# EAGLE schematic CHARGING_CIRCUIT_EXTERNAL (EAGLE 8.4.1)
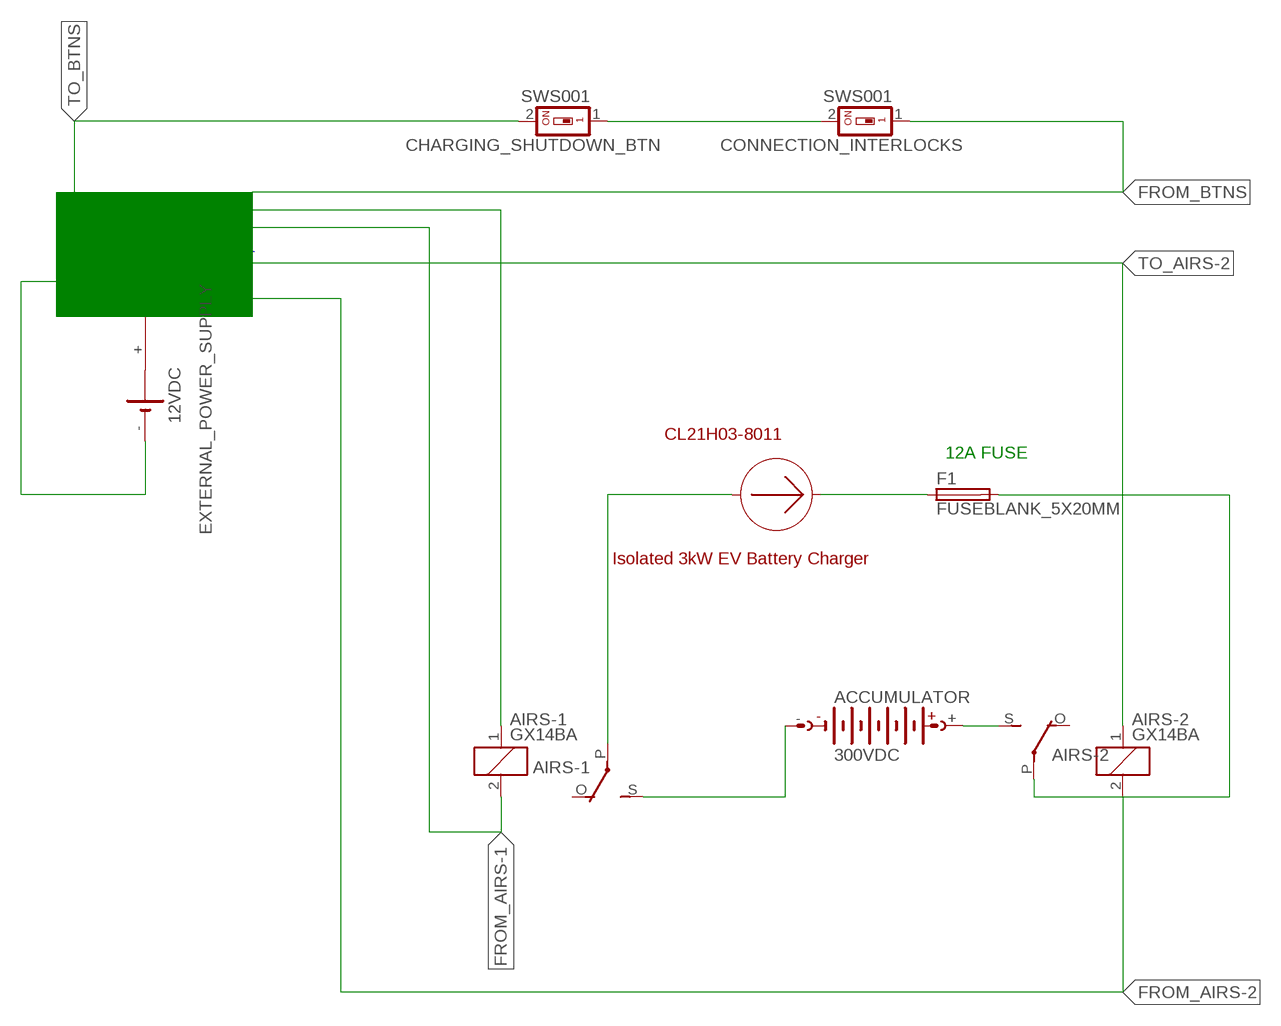
[diagram p0: schematic, sheet 1]

## Parts
ACCUMULATOR  300VDC  AB9V  [AB9V]
AIRS-1  GX14BA  V23127A  [V23127A]
AIRS-2  GX14BA  V23127A  [V23127A]
CHARGING_SHUTDOWN_BTN  SWS001  [SMS-001]
CL21H03-8011  Isolated 3kW EV Battery Charger  CURRENT  (no package)
CONNECTION_INTERLOCKS  SWS001  [SMS-001]
EXTERNAL_POWER_SUPPLY  12VDC  B2430UNI  [B2430UNI]
F1  FUSEBLANK_5X20MM  [FUSE_HOLDER_5X20MM]

## Nets
FROM_AIRS-1: AIRS-1.2
FROM_AIRS-2: AIRS-2.2
FROM_BTNS: CONNECTION_INTERLOCKS.1
N$1: EXTERNAL_POWER_SUPPLY.-
N$2: AIRS-2.P(2:P) F1.2
N$3: AIRS-1.P(2:P) CL21H03-8011.+
N$4: CL21H03-8011.- F1.1
N$5: CHARGING_SHUTDOWN_BTN.1 CONNECTION_INTERLOCKS.2
N$12: ACCUMULATOR.- AIRS-1.S(2:S)
N$14: ACCUMULATOR.+ AIRS-2.S(2:S)
TO_AIRS-1: AIRS-1.1
TO_AIRS-2: AIRS-2.1
TO_BTNS: CHARGING_SHUTDOWN_BTN.2
Unconnected: AIRS-1.O(2:O) AIRS-2.O(2:O) EXTERNAL_POWER_SUPPLY.+ EXTERNAL_POWER_SUPPLY.+@1(+) EXTERNAL_POWER_SUPPLY.+@2(+) EXTERNAL_POWER_SUPPLY.+@3(+) EXTERNAL_POWER_SUPPLY.+@4(+) EXTERNAL_POWER_SUPPLY.-@1(-)

## Notes on the sheet
- SHUTDOWN CIRCUIT
- 12A FUSE

## Library data of the parts
ACCUMULATOR = battery:AB9V: 9-V BATTERY CLIP
AIRS-1 AIRS-2 = relay:V23127A: RELAY horizontal, 1 x switch, 5 A/300 V DC, 250 V AC, Siemens; OC_FARNELL: unknown; OC_NEWARK: unknown
CHARGING_SHUTDOWN_BTN CONNECTION_INTERLOCKS = smd-special:SWS001: SMD Dip Switch 1 pol.
CL21H03-8011 = ngspice-simulation:CURRENT: Independent Current Source; VALUE: 0A
EXTERNAL_POWER_SUPPLY = battery:B2430UNI: LI BATTERY
F1 = fuse:FUSE: Fuse; OC_FARNELL: unknown; OC_NEWARK: unknown